# Altium schematic sheet TS5USBC41.SchDoc
size A4; SheetNumber: 4; SheetTotal: 8
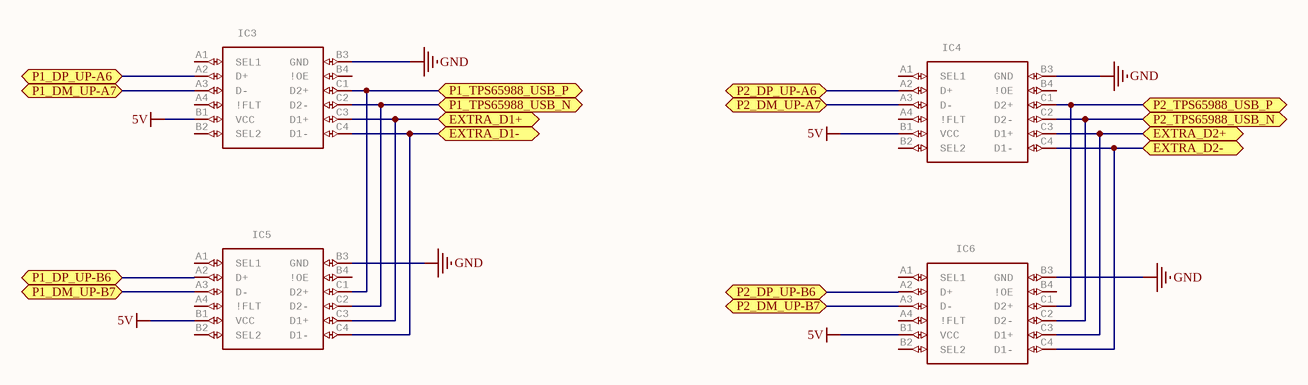
[diagram p0: TS5USBC41.SchDoc]

## Parts
IC3  Dual 2:1 USB 2.0 Mux/DeMux or Single Ended Cross Switch With 20-V/24-V OVP   Source:  Datasheet  [BGA12C40P4X3_160X120X62]  (value not drawn)
IC4  Dual 2:1 USB 2.0 Mux/DeMux or Single Ended Cross Switch With 20-V/24-V OVP   Source:  Datasheet  [BGA12C40P4X3_160X120X62]  (value not drawn)
IC5  Dual 2:1 USB 2.0 Mux/DeMux or Single Ended Cross Switch With 20-V/24-V OVP   Source:  Datasheet  [BGA12C40P4X3_160X120X62]  (value not drawn)
IC6  Dual 2:1 USB 2.0 Mux/DeMux or Single Ended Cross Switch With 20-V/24-V OVP   Source:  Datasheet  [BGA12C40P4X3_160X120X62]  (value not drawn)

## Ports
EXTRA_D1+ (bidir), EXTRA_D1- (bidir), EXTRA_D2+ (bidir), EXTRA_D2- (bidir), P1_DM_UP-A7 (bidir), P1_DM_UP-B7 (bidir), P1_DP_UP-A6 (bidir), P1_DP_UP-B6 (bidir), P1_TPS65988_USB_N (bidir), P1_TPS65988_USB_P (bidir), P2_DM_UP-A7 (bidir), P2_DM_UP-B7 (bidir), P2_DP_UP-A6 (bidir), P2_DP_UP-B6 (bidir), P2_TPS65988_USB_N (bidir), P2_TPS65988_USB_P (bidir)

## Nets
5V: IC3.B1(VCC) IC4.B1(VCC) IC5.B1(VCC) IC6.B1(VCC)
GND: IC3.B3(GND) IC4.B3(GND) IC5.B3(GND) IC6.B3(GND)
EXTRA_D1+: IC3.C3(D1+) IC5.C3(D1+) ; port EXTRA_D1+
EXTRA_D1-: IC3.C4(D1-) IC5.C4(D1-) ; port EXTRA_D1-
EXTRA_D2+: IC4.C3(D1+) IC6.C3(D1+) ; port EXTRA_D2+
EXTRA_D2-: IC4.C4(D1-) IC6.C4(D1-) ; port EXTRA_D2-
P1_DM_UP-A7: IC3.A3(D-) ; port P1_DM_UP-A7
P1_DM_UP-B7: IC5.A3(D-) ; port P1_DM_UP-B7
P1_DP_UP-A6: IC3.A2(D+) ; port P1_DP_UP-A6
P1_DP_UP-B6: IC5.A2(D+) ; port P1_DP_UP-B6
P1_TPS65988_USB_N: IC3.C2(D2-) IC5.C2(D2-) ; port P1_TPS65988_USB_N
P1_TPS65988_USB_P: IC3.C1(D2+) IC5.C1(D2+) ; port P1_TPS65988_USB_P
P2_DM_UP-A7: IC4.A3(D-) ; port P2_DM_UP-A7
P2_DM_UP-B7: IC6.A3(D-) ; port P2_DM_UP-B7
P2_DP_UP-A6: IC4.A2(D+) ; port P2_DP_UP-A6
P2_DP_UP-B6: IC6.A2(D+) ; port P2_DP_UP-B6
P2_TPS65988_USB_N: IC4.C2(D2-) IC6.C2(D2-) ; port P2_TPS65988_USB_N
P2_TPS65988_USB_P: IC4.C1(D2+) IC6.C1(D2+) ; port P2_TPS65988_USB_P

Not connected (* = marked no-connect by the designer): IC3 A1(SEL1) A4(!FLT) B2(SEL2) B4(!OE); IC4 A1(SEL1) A4(!FLT) B2(SEL2) B4(!OE); IC5 A1(SEL1) A4(!FLT) B2(SEL2) B4(!OE); IC6 A1(SEL1) A4(!FLT) B2(SEL2) B4(!OE)

## Library data of the parts
IC3-IC6 = TS5USBC410IYFFR: Manufacturer_Name: Texas Instruments; GateName_1: G$1; SymbolName_1: TS5USBC410IYFFR; LibraryName: TS5USBC410IYFFR; DeviceSetName: TS5USBC410IYFFR; Package: BGA12C40P4X3_160X120X62; Manufacturer_Part_Number: TS5USBC410IYFFR; Mouser_Part_Number: 595-TS5USBC410IYFFR; Mouser_Price-Stock: https://www.mouser.co.uk/ProductDetail/Texas-Instruments/TS5USBC410IYFFR?qs=F5EMLAvA7IAhys8Eb8O2UQ%3D%3D; Arrow_Part_Number: TS5USBC410IYFFR; Arrow_Price-Stock: https://www.arrow.com/en/products/ts5usbc410iyffr/texas-instruments?region=nac; Height: 0.625mm